# EasyEDA schematic SCH_SemaforkyNG.EasyEDA.json
TITLE: Sheet_1; REV: 1.0; Date: 2023-02-12; Sheet: 1/1; Drawn By: vaclav.krajicek; Company: Your Company
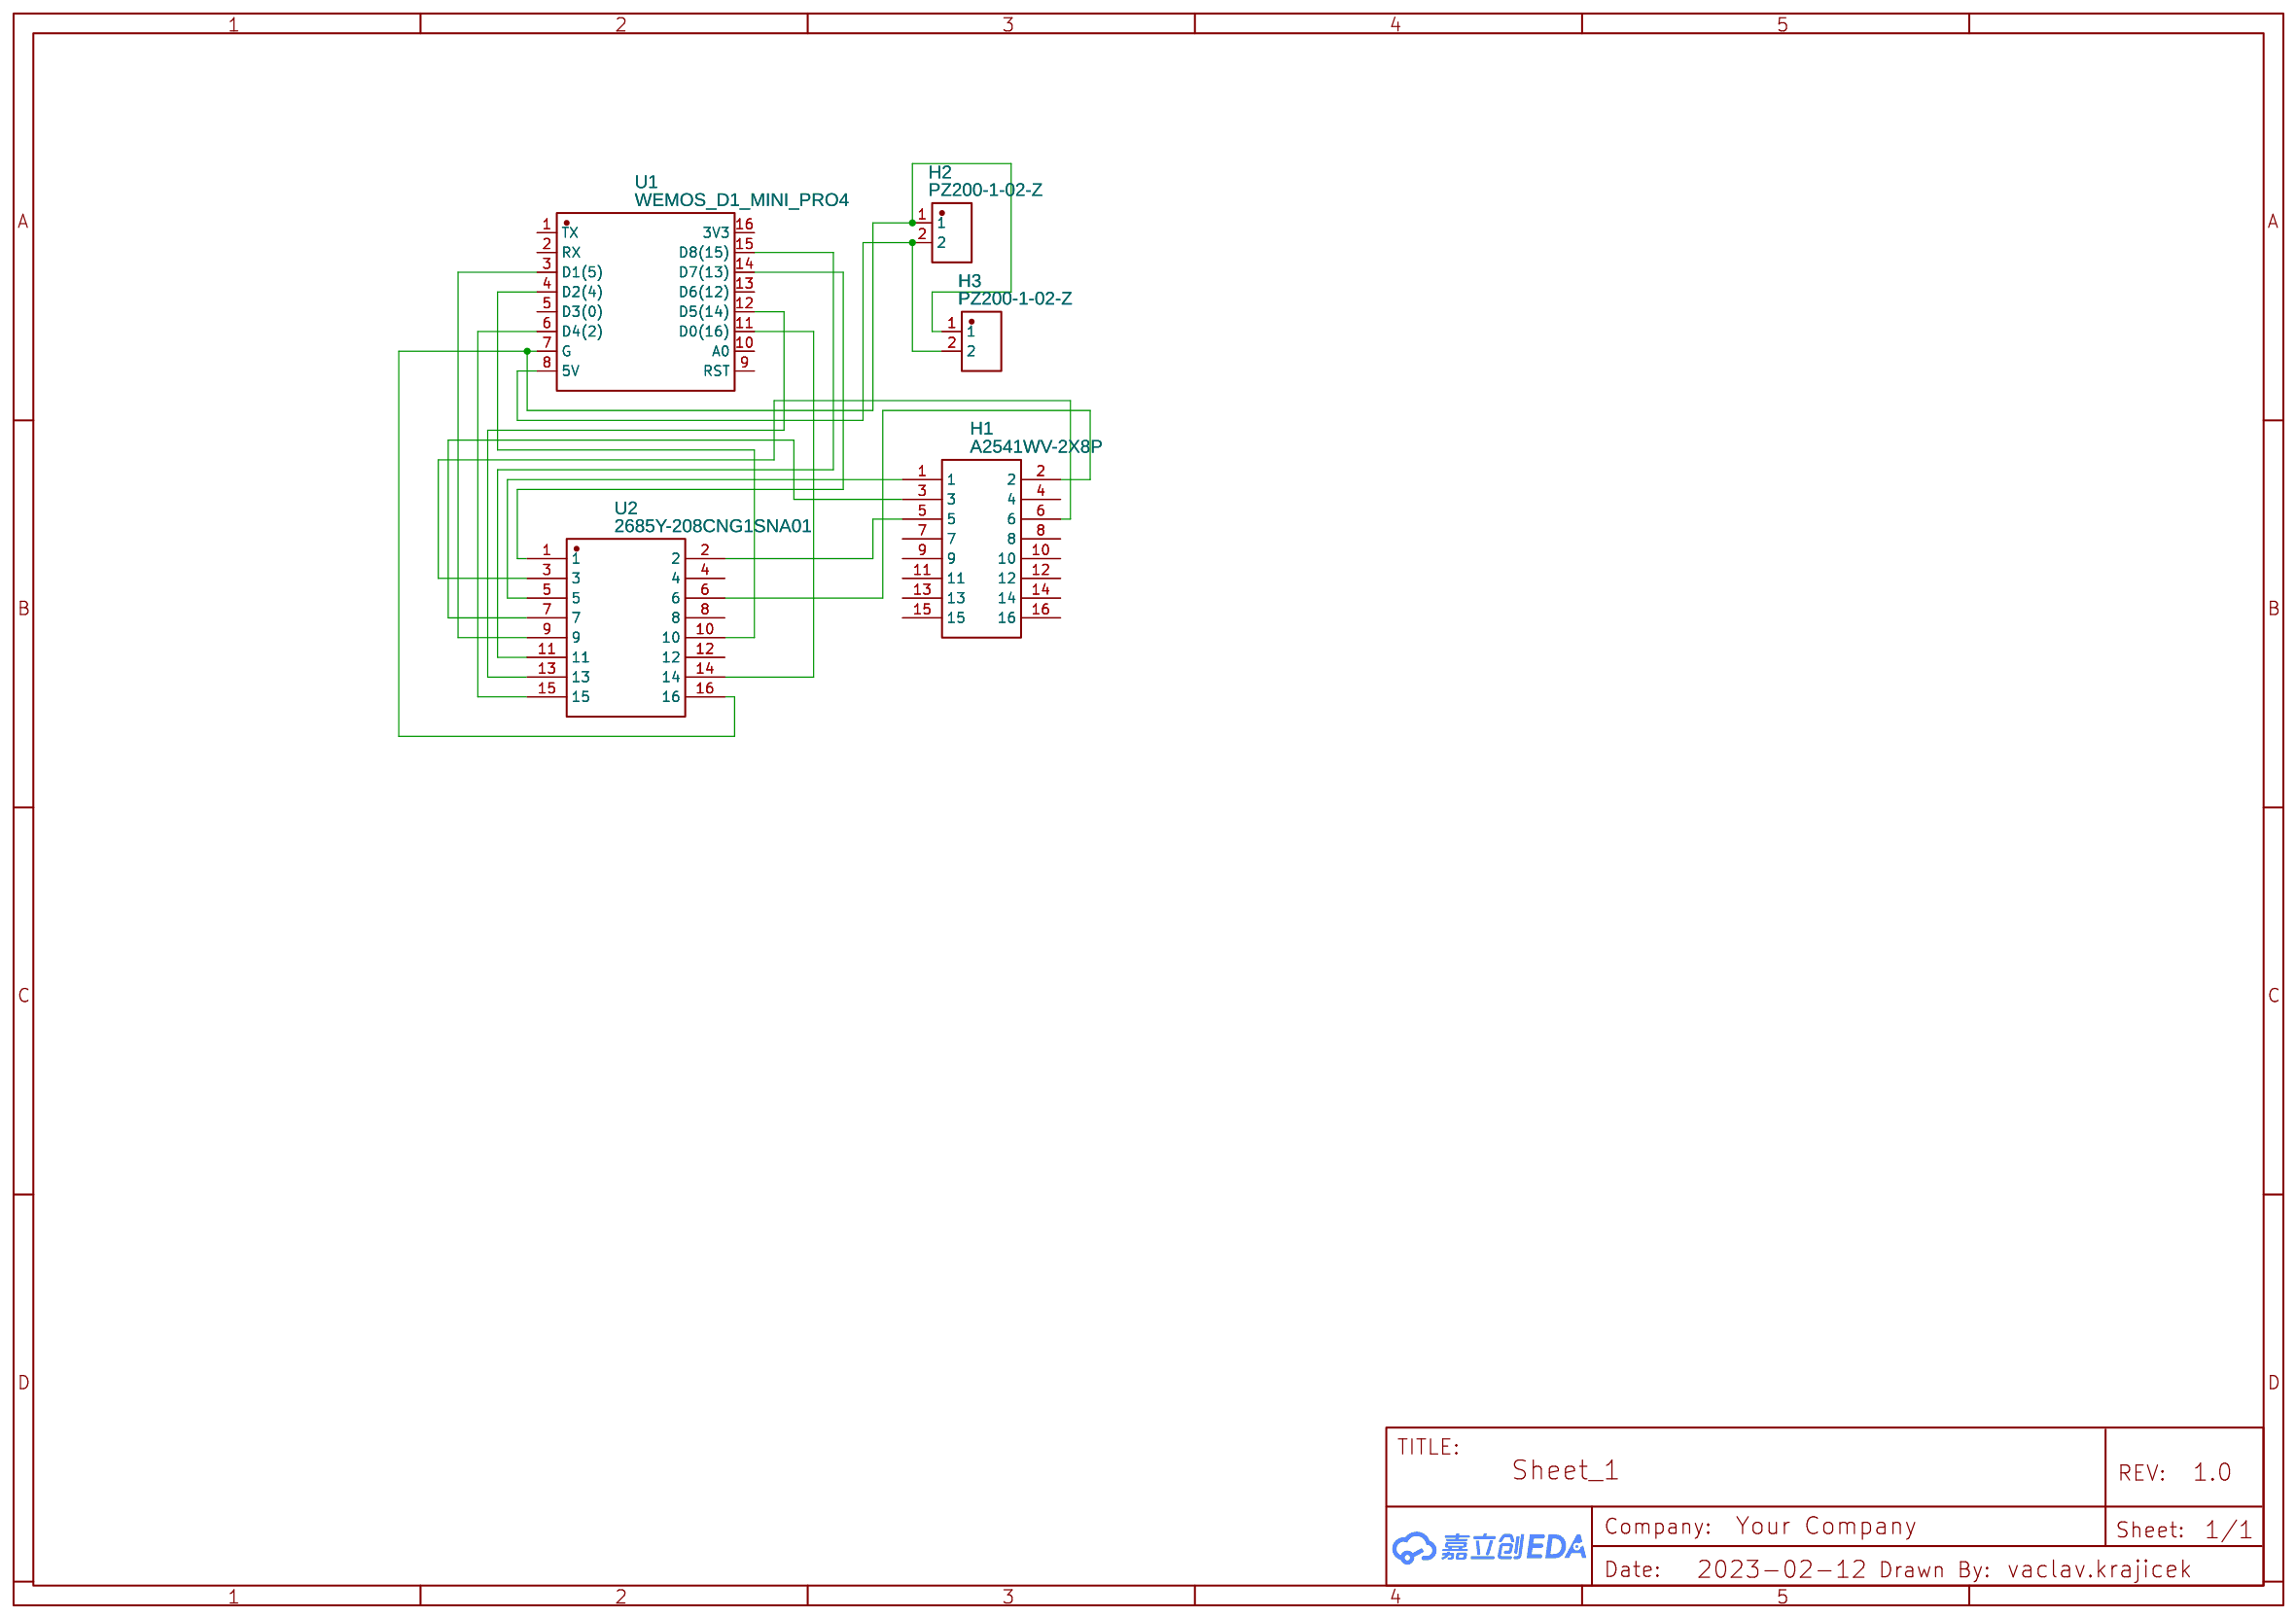
[diagram p0: schematic sheet]

## Parts
H1  A2541WV-2X8P  [HDR-TH_16P-P2.54-V-M-R2-C8-S2.54-1]
H2  PZ200-1-02-Z  [HDR-TH_2P-P2.00-V-M]
H3  PZ200-1-02-Z  [HDR-TH_2P-P2.00-V-M]
U1  WEMOS_D1_MINI_PRO4  [DIP-16_WEMOS_D1_MINI_PRO4]
U2  2685Y-208CNG1SNA01  [HDR-TH_16P-P2.54-V-F-R2-C8-S2.54]

## Library data of the parts
H1 = A2541WV-2X8P: Supplier: LCSC; Supplier Part: C225523; Manufacturer: CJT(长江连接器); Manufacturer Part: A2541WV-2x8P; Contributor: LCSC; JLCPCB Part Class: Extended Part
H2 H3 = PZ200-1-02-Z: Supplier: LCSC; Supplier Part: C2905948; Manufacturer: HCTL(华灿天禄); Contributor: LCSC; JLCPCB Part Class: Extended Part
U1 = WEMOS_D1_MINI_PRO4: Supplier: LCSC; Supplier Part: C2837266; Manufacturer: null; Manufacturer Part: Wemos_D1_mini_Pro4; Contributor: LCSC; JLCPCB Part Class: Extended Part
U2 = 2685Y-208CNG1SNA01: Supplier: LCSC; Supplier Part: C350292; Manufacturer: 华宇创; Contributor: LCSC; JLCPCB Part Class: Extended Part

## Nets
Net-(H1-1): H1.1 U2.5
Net-(H1-2): H1.2 U2.6
Net-(H1-3): H1.3 U2.7
Net-(H1-5): H1.5 U2.2
Net-(H1-6): H1.6 U2.3
Net-(H2-1): H2.1 H3.1 U1.7(G) U2.16
Net-(H2-2): H2.2 H3.2 U1.8(5V)
Net-(U1-3): U1.3(D1(5)) U2.9
Net-(U1-4): U1.4(D2(4)) U2.10
Net-(U1-6): U1.6(D4(2)) U2.15
Net-(U1-11): U1.11(D0(16)) U2.14
Net-(U1-12): U1.12(D5(14)) U2.13
Net-(U1-14): U1.14(D7(13)) U2.1
Net-(U1-15): U1.15(D8(15)) U2.11

Not connected (* = marked no-connect by the designer): H1 4 7 8 9 10 11 12 13 14 15 16; U1 1(TX) 2(RX) 5(D3(0)) 9(RST) 10(A0) 13(D6(12)) 16(3V3); U2 4 8 12
